# EAGLE design MainBoard (EAGLE 9.4.2)
MF: YAGEO

## Sheet 1 of 2: Power
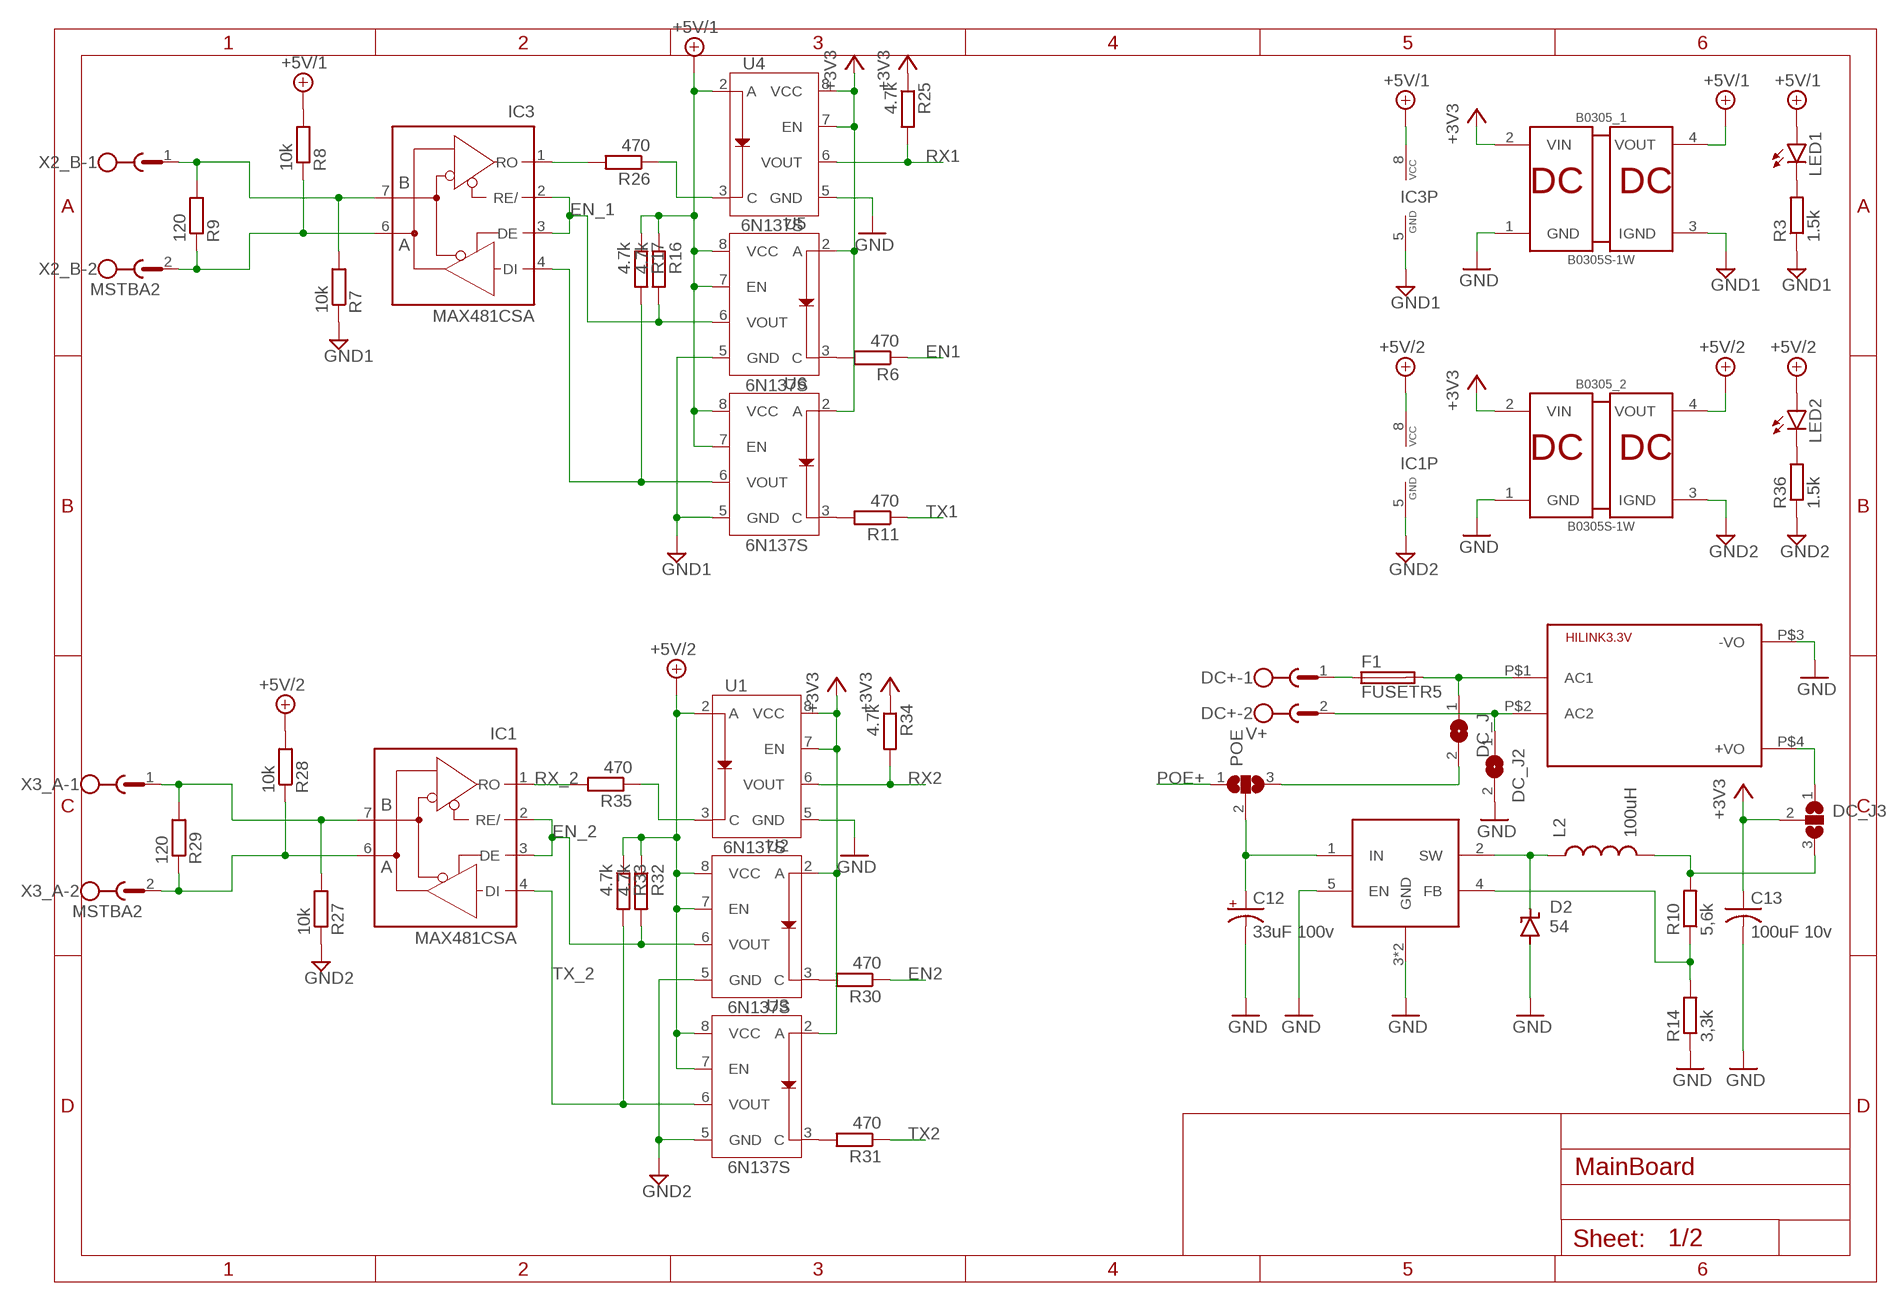
[diagram p0: schematic, sheet 1]

### Parts
B0305_1  B0305S-1W  [B_S-1W]
B0305_2  B0305S-1W  [B_S-1W]
C12  33uF 100v  CPOL-US150CLZ-0810  [150CLZ-0810]
C13  100uF 10v  C-USC1206  [C1206]
D2  54  SUPPRESSOR-SMBJ  [SMBJ]
DC+  V+  MSTBA2  [MSTBA2]
DC_J  SJW  [SJW]
DC_J2  SJW  [SJW]
DC_J3  SJ2W  [SJ_2]
F1  FUSETR5  [TR5]
HILINK3.3V  HLK-PM013W  [HLK-PM01]
IC1  MAX481CSA  [SO08]
IC3  MAX481CSA  [SO08]
L2  100uH  INDUCTOR68UH-1A  [CR75]
LED1  LEDSML1206  [SML1206]
LED2  LEDSML1206  [SML1206]
POE  SJ2W  [SJ_2]
R3  1.5k  R-EU_R0805  [R0805]
R6  470  R-EU_R0805  [R0805]
R7  10k  R-EU_R0805  [R0805]
R8  10k  R-EU_R0805  [R0805]
R9  120  R-EU_R0805  [R0805]
R10  5,6k  R-EU_R0805  [R0805]
R11  470  R-EU_R0805  [R0805]
R14  3,3k  R-EU_R0805  [R0805]
R16  4.7k  R-EU_R0805  [R0805]
R17  4.7k  R-EU_R0805  [R0805]
R25  4.7k  R-EU_R0805  [R0805]
R26  470  R-EU_R0805  [R0805]
R27  10k  R-EU_R0805  [R0805]
R28  10k  R-EU_R0805  [R0805]
R29  120  R-EU_R0805  [R0805]
R30  470  R-EU_R0805  [R0805]
R31  470  R-EU_R0805  [R0805]
R32  4.7k  R-EU_R0805  [R0805]
R33  4.7k  R-EU_R0805  [R0805]
R34  4.7k  R-EU_R0805  [R0805]
R35  470  R-EU_R0805  [R0805]
R36  1.5k  R-EU_R0805  [R0805]
U1  6N137S  [8-SMD]
U2  6N137S  [8-SMD]
U3  6N137S  [8-SMD]
U4  6N137S  [8-SMD]
U5  6N137S  [8-SMD]
U6  6N137S  [8-SMD]
U9  XL7015  [TO252-51]
X2_B  MSTBA2  [MSTBA2]
X3_A  MSTBA2  [MSTBA2]

### Nets
+3V3: B0305_1.2(VIN) B0305_2.2(VIN) C13.1 DC_J3.2 R25.1 R34.1 U1.7(EN) U1.8(VCC) U2.2(A) U3.2(A) U4.7(EN) U4.8(VCC) U5.2(A) U6.2(A) ; also sheet 2
+5V/1: B0305_1.4(VOUT) IC3.8(VCC) LED1.A R8.2 R16.1 R17.1 U4.2(A) U5.7(EN) U5.8(VCC) U6.7(EN) U6.8(VCC)
+5V/2: B0305_2.4(VOUT) IC1.8(VCC) LED2.A R28.2 R32.1 R33.1 U1.2(A) U2.7(EN) U2.8(VCC) U3.7(EN) U3.8(VCC)
EN1: R6.1 ; also sheet 2
EN2: R30.1 ; also sheet 2
EN_1: IC3.2(RE/) IC3.3(DE) R16.2 U5.6(VOUT)
EN_2: IC1.2(RE/) IC1.3(DE) R32.2 U2.6(VOUT)
GND: B0305_1.1(GND) B0305_2.1(GND) C12.- C13.2 D2.A DC_J2.2 HILINK3.3V.P$3(-VO) R14.1 U1.5(GND) U4.5(GND) U9.3(GND) U9.5(EN) U9.GND ; also sheet 2
GND1: B0305_1.3(IGND) IC3.5(GND) R3.1 R7.1 U5.5(GND) U6.5(GND)
GND2: B0305_2.3(IGND) IC1.5(GND) R27.1 R36.1 U2.5(GND) U3.5(GND)
N$1: LED1.C R3.2
N$3: IC3.7(B) R7.2 R9.2 X2_B.1
N$4: IC3.6(A) R8.1 R9.1 X2_B.2
N$6: R10.1 R14.2 U9.4(FB)
N$7: DC_J.2 POE.3
N$8: D2.C L2.P$1 U9.2(SW)
N$9: DC+.2 DC_J2.1 HILINK3.3V.P$2(AC2)
N$10: DC+.1 F1.1
N$11: DC_J3.3 L2.P$2 R10.2
N$12: R6.2 U5.3(C)
N$13: R11.2 U6.3(C)
N$14: IC1.7(B) R27.2 R29.2 X3_A.1
N$15: R26.1 U4.3(C)
N$16: IC1.6(A) R28.1 R29.1 X3_A.2
N$17: R30.2 U2.3(C)
N$18: R31.2 U3.3(C)
N$19: R35.1 U1.3(C)
N$20: LED2.C R36.2
N$22: DC_J3.1 HILINK3.3V.P$4(+VO)
N$26: C12.+ POE.2 U9.1(IN)
N$27: DC_J.1 F1.2 HILINK3.3V.P$1(AC1)
POE+: POE.1 ; also sheet 2
RX1: R25.2 U4.6(VOUT) ; also sheet 2
RX2: R34.2 U1.6(VOUT) ; also sheet 2
RX485: IC3.1(RO) R26.2
RX_2: IC1.1(RO) R35.2
TX1: R11.1 ; also sheet 2
TX2: R31.1 ; also sheet 2
TX485: IC3.4(DI) R17.2 U6.6(VOUT)
TX_2: IC1.4(DI) R33.2 U3.6(VOUT)

## Sheet 2 of 2: LAN
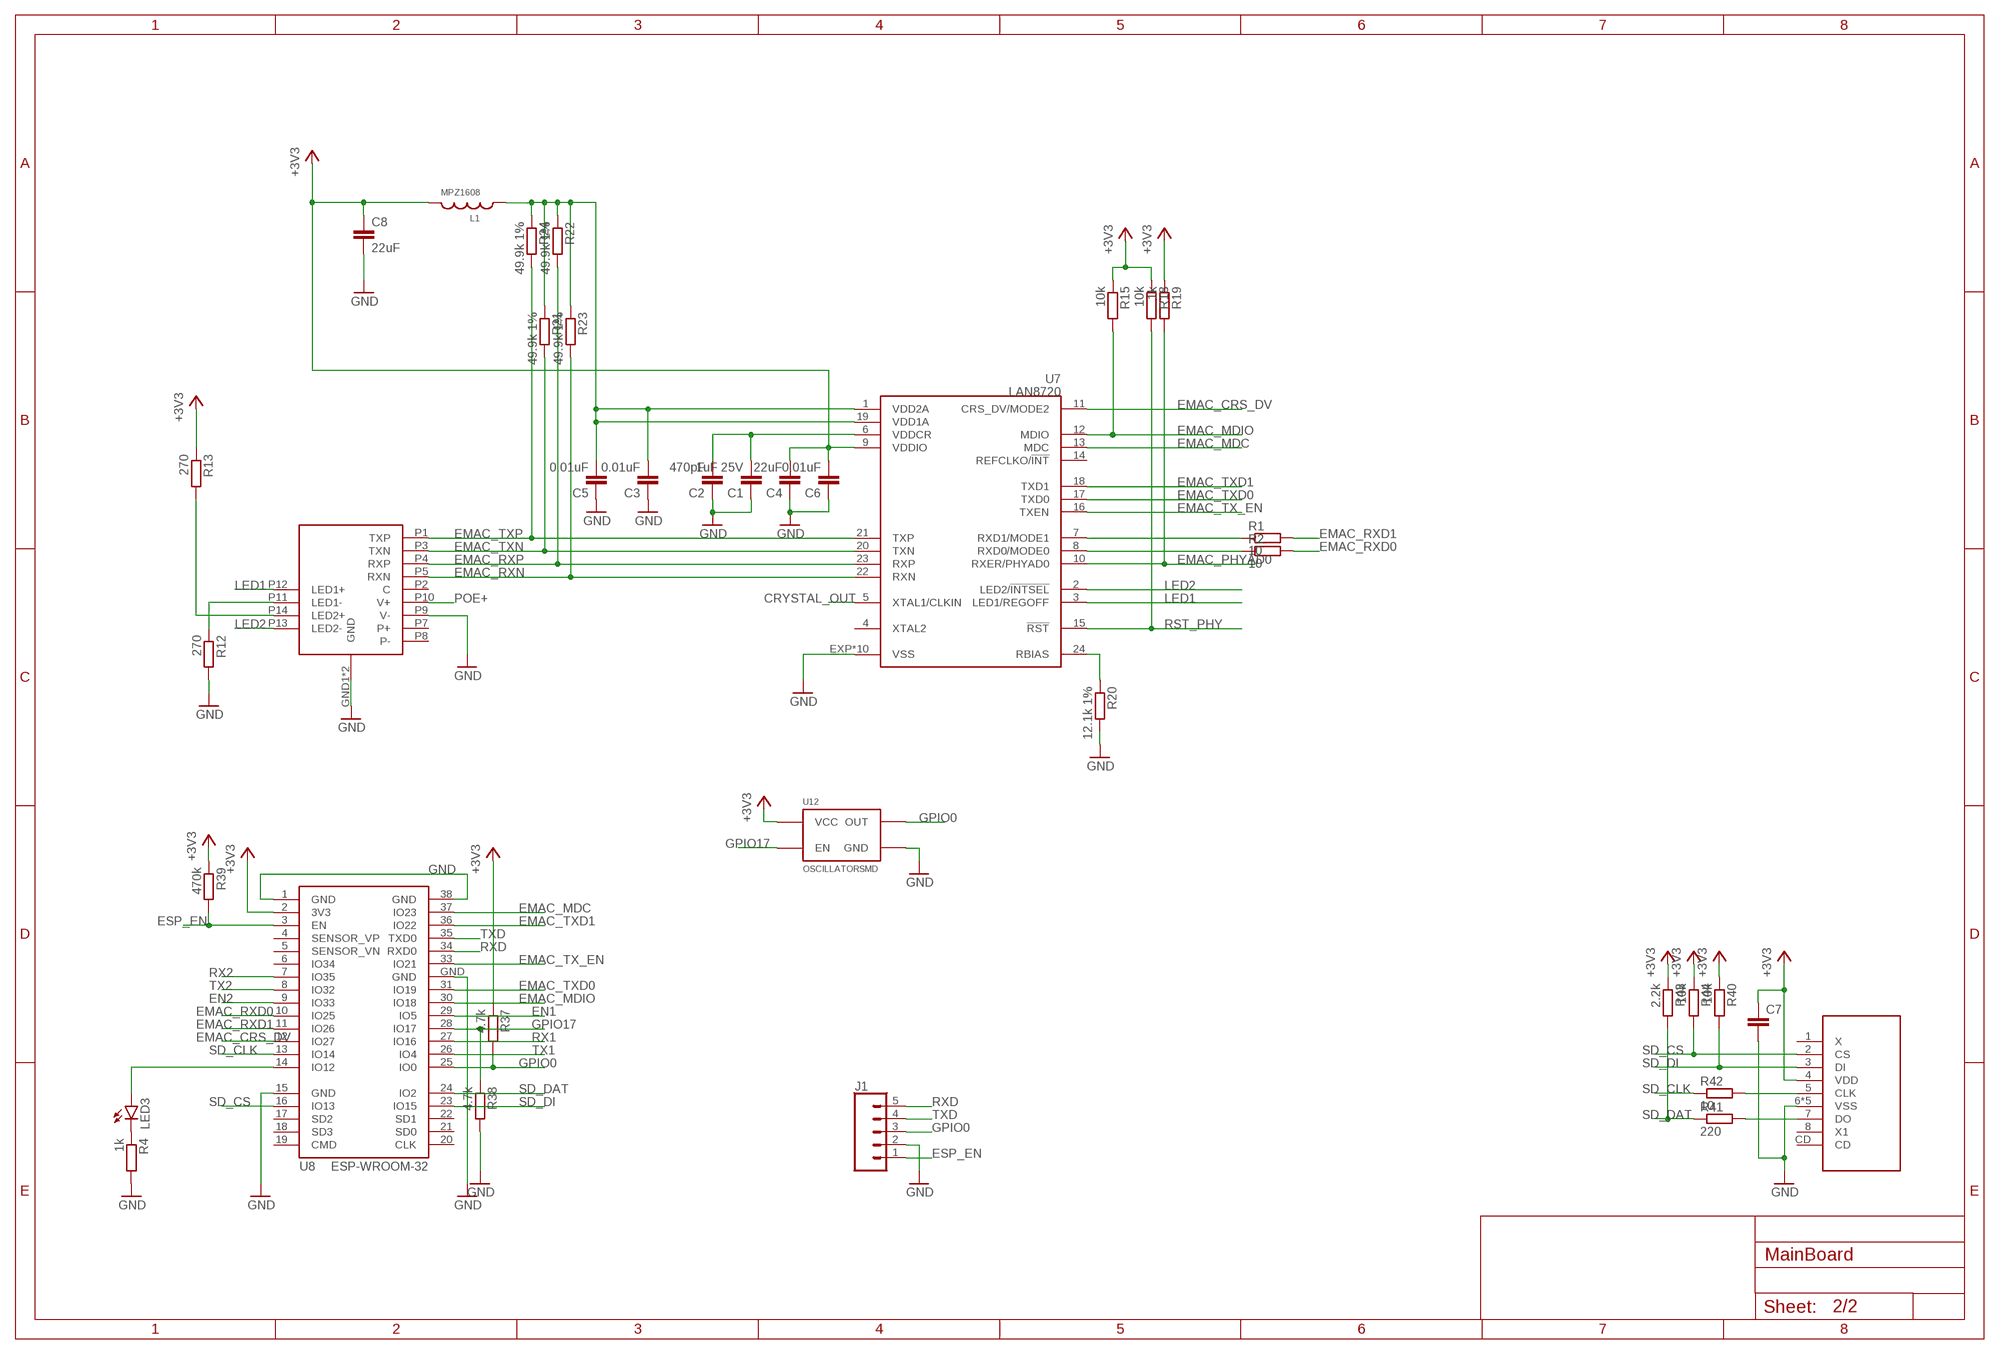
[diagram p1: schematic, sheet 2]

### Parts
C1  1uF 25V  C-EUC0805  [C0805]
C2  470pF  C-EUC0805  [C0805]
C3  0.01uF  C-EUC0805  [C0805]
C4  22uF  C-EUC0805  [C0805]
C5  0.01uF  C-EUC0805  [C0805]
C6  0.01uF  C-EUC0805  [C0805]
C7  C-EUC1206  [C1206]
C8  22uF  C-EUC0805  [C0805]
J1  CONN_05LOCK  [1X05_LOCK]
L1  MPZ1608  [1608]
LED3  LEDSML1206  [SML1206]
R1  10  R-EU_R0805  [R0805]
R2  10  R-EU_R0805  [R0805]
R4  1k  R-EU_R0805  [R0805]
R12  270  R-EU_R0805  [R0805]
R13  270  R-EU_R0805  [R0805]
R15  10k  R-EU_R0805  [R0805]
R18  10k  R-EU_R0805  [R0805]
R19  1k  R-EU_R0805  [R0805]
R20  12.1k 1%  R-EU_R0805  [R0805]
R21  49.9k 1%  R-EU_R0805  [R0805]
R22  49.9k 1%  R-EU_R0805  [R0805]
R23  49.9k 1%  R-EU_R0805  [R0805]
R24  49.9k 1%  R-EU_R0805  [R0805]
R37  4.7k  R-EU_R0805  [R0805]
R38  4.7k  R-EU_R0805  [R0805]
R39  470k  R-EU_R0805  [R0805]
R40  10k  R-EU_R0805  [R0805]
R41  220  R-EU_R0805  [R0805]
R42  10  R-EU_R0805  [R0805]
R43  2.2k  R-EU_R0805  [R0805]
R44  10k  R-EU_R0805  [R0805]
U7  LAN8720  [QFN24]
U8  ESP-WROOM-32  [ESP-WROOM-32]
U12  OSCILLATORSMD  [CRYSTAL-SMD-7X5]
U$1  MICROSD  [MICROSDCARD]
U$2  RJ45-1169  [RJ45-1169]

### Nets
+3V3: C4.2 C6.2 C7.1 C8.1 L1.P$2 R13.1 R15.1 R18.1 R19.1 R37.1 R39.1 R40.1 R43.1 R44.1 U7.9(VDDIO) U8.2(3V3) U12.P$4(VCC) U$1.4(VDD) ; also sheet 1
CRYSTAL_OUT: U7.5(XTAL1/CLKIN)
EMAC_CRS_DV: U7.11(CRS_DV/MODE2) U8.12(IO27)
EMAC_MDC: U7.13(MDC) U8.37(IO23)
EMAC_MDIO: R15.2 U7.12(MDIO) U8.30(IO18)
EMAC_PHYAD0: R19.2 U7.10(RXER/PHYAD0)
EMAC_RBIAS: R20.1 U7.24(RBIAS)
EMAC_RXD0: R2.2 U8.10(IO25)
EMAC_RXD0_LAN: R2.1 U7.8(RXD0/MODE0)
EMAC_RXD1: R1.2 U8.11(IO26)
EMAC_RXD1_LAN: R1.1 U7.7(RXD1/MODE1)
EMAC_RXN: R23.2 U7.22(RXN) U$2.P5(RXN)
EMAC_RXP: R22.2 U7.23(RXP) U$2.P4(RXP)
EMAC_TX_EN: U7.16(TXEN) U8.33(IO21)
EMAC_TXD0: U7.17(TXD0) U8.31(IO19)
EMAC_TXD1: U7.18(TXD1) U8.36(IO22)
EMAC_TXN: R21.2 U7.20(TXN) U$2.P3(TXN)
EMAC_TXP: R24.2 U7.21(TXP) U$2.P1(TXP)
EMAC_VDDCR: C1.2 C2.2 U7.6(VDDCR)
EMAC_VDDXA: C3.2 C5.2 L1.P$1 R21.1 R22.1 R23.1 R24.1 U7.1(VDD2A) U7.19(VDD1A)
EN1: U8.29(IO5) ; also sheet 1
EN2: U8.9(IO33) ; also sheet 1
ESP_EN: J1.1 R39.2 U8.3(EN)
GND: C1.1 C2.1 C3.1 C4.1 C5.1 C6.1 C7.2 C8.2 J1.2 R4.2 R12.2 R20.2 R38.2 U7.EXP(VSS) U7.GND1(VSS) U7.GND2(VSS) U7.GND3(VSS) U7.GND4(VSS) U7.GND5(VSS) U7.GND6(VSS) U7.GND7(VSS) U7.GND8(VSS) U7.GND9(VSS) U8.1(GND) U8.15(GND) U8.38(GND) U8.GND U12.P$2(GND) U$1.6(VSS) U$1.GND1(VSS) U$1.GND2(VSS) U$1.GND3(VSS) U$1.GND(VSS) U$2.GND1(GND) U$2.GND2(GND) U$2.P9(V-) ; also sheet 1
GPIO0: J1.3 R37.2 U8.25(IO0) U12.P$3(OUT)
GPIO17: R38.1 U8.28(IO17) U12.P$1(EN)
LED1: U7.3(LED1/REGOFF) U$2.P12(LED1+)
LED2: U7.2(LED2/!INTSEL) U$2.P13(LED2-)
N$2: R13.2 U$2.P14(LED2+)
N$5: R12.1 U$2.P11(LED1-)
N$21: LED3.A U8.14(IO12)
N$23: LED3.C R4.1
N$24: R41.2 U$1.7(DO)
N$25: R42.2 U$1.5(CLK)
POE+: U$2.P10(V+) ; also sheet 1
RST_PHY: R18.2 U7.15(!RST)
RX1: U8.27(IO16) ; also sheet 1
RX2: U8.7(IO35) ; also sheet 1
RXD: J1.5 U8.34(RXD0)
SD_CLK: R42.1 U8.13(IO14)
SD_CS: R44.2 U8.16(IO13) U$1.2(CS)
SD_DAT: R41.1 R43.2 U8.24(IO2)
SD_DI: R40.2 U8.23(IO15) U$1.3(DI)
TX1: U8.26(IO4) ; also sheet 1
TX2: U8.8(IO32) ; also sheet 1
TXD: J1.4 U8.35(TXD0)
Unconnected: U7.4(XTAL2) U7.14(REFCLKO/!INT) U8.4(SENSOR_VP) U8.5(SENSOR_VN) U8.6(IO34) U8.17(SD2) U8.18(SD3) U8.19(CMD) U8.20(CLK) U8.21(SD0) U8.22(SD1) U$1.1(X) U$1.8(X1) U$1.CD U$2.P2(C) U$2.P7(P+) U$2.P8(P-)

## Library data of the parts
B0305_1 B0305_2 = mornsun:B0305S-1W: 1W, fixed input isolated & unregulated DCDC converter in a miniature sip/dip package
C1 = rcl:C-EU: CAPACITOR, European symbol; MF: YAGEO; MPN: CC0603KPX7R8BB105; SPICEPREFIX: C
C2 = rcl:C-EU: CAPACITOR, European symbol; MF: YAGEO; MPN: CC0603JRX7R7BB471; SPICEPREFIX: C
C3-C6 = rcl:C-EU: CAPACITOR, European symbol; MF: YAGEO; MPN: CC0603KRX7R6BB103; SPICEPREFIX: C
C7 = rcl:C-EU: CAPACITOR, European symbol; SPICEPREFIX: C
C8 = rcl:C-EU: CAPACITOR, European symbol; MF: YAGEO; MPN: CC0603MPX5R5BB226; SPICEPREFIX: C
C12 = rcl:CPOL-US: POLARIZED CAPACITOR, American symbol; SPICEPREFIX: C
C13 = rcl:C-US: CAPACITOR, American symbol; SPICEPREFIX: C
D2 = diode:SUPPRESSOR-: Suppressor diode
DC+ X2_B X3_A = con-phoenix-508:MSTBA2: PHOENIX; MF: FARNELL; MPN: 1757242; OC_FARNELL: 3705171; OC_NEWARK: 71C4161
DC_J DC_J2 = jumper:SJ: SMD solder JUMPER
DC_J3 POE = jumper:SJ2W: SMD solder JUMPER
F1 = fuse:FUSE: Fuse; OC_FARNELL: unknown; OC_NEWARK: unknown
HILINK3.3V = hi-link:HLK-PM01: Hi-Link Power Supply HLK-PM01 3W Author: Ahmed Said <https://github.com/AhmedSaid/EAGLELibraries>
IC1 IC3 = maxim:MAX481CSA: RS485 TRANSEIVER; MF: MAXIM; MPN: MAX481CSA; OC_FARNELL: unknown; OC_NEWARK: 90C3817
J1 = SparkFun-Connectors:CONN_05: Multi connection point. Often used as Generic Header-pin footprint for 0.1 inch spaced/style header connections On any of the 0.1 inch spaced packages, you can populate with these: Break Away Headers - Straight <https://www.sparkfun.com/products/116> (PRT-00116) Break Away Male Headers - Right Angle <https://www.sparkfun.com/products/553> (PRT-00553) Female Headers <https://www.sparkfun.com/products/115> (PRT-00115) Break Away Headers - Machine Pin <https://www.sparkfun.com/products/117> (PRT-00117) Break Away Female Headers - Swiss Machine Pin <https://www.sparkfun.com/products/743> (PRT-00743) For SCREWTERMINALS and SPRING TERMINALS visit here: Screw Terimnals on SparkFun.com <https://www.sparkfun.com/search/results?term=Screw+Terminals> (5mm/3.5mm/2.54mm spacing) This device is also useful as a general connection point to wire up your design to another part of your project. Our various solder wires solder well into these plated through hole pads. Hook-Up Wire - Assortment (Stranded, 22 AWG) <https://www.sparkfun.com/products/11375> (PRT-11375) Hook-Up Wire - Assortment (Solid Core, 22 AWG) <https://www.sparkfun.com/products/11367> (PRT-11367) View the entire wire category on our website here <https://www.sparkfun.com/categories/141> Special notes: Molex polarized connector foot print use with SKU : PRT-08231 with associated crimp pins and housings. 1MM SMD Version SKU: PRT-10208
L1 = candel:MPZ1608: Chip beads for power line MPZ series
L2 = SparkFun-Passives:INDUCTOR: Inductors Basic Inductor/Choke - 0603 and 1206. Footprints are not proven and vary greatly between part numbers. INDUCTOR POWER 3.3UH 4.0A SMD 0.197" L x 0.197" W x 0.177" H (5.00mm x 5.00mm x 4.50mm); PROD_ID: NDUC-09739; VALUE: 68uH
LED1-LED3 = led:LED: LED OSRAM: - CHIPLED LG R971, LG N971, LY N971, LG Q971, LY Q971, LO R971, LY R971 LH N974, LH R974 LS Q976, LO Q976, LY Q976 LO Q996 - Hyper CHIPLED LW Q18S LB Q993, LB Q99A, LB R99A - SideLED LS A670, LO A670, LY A670, LG A670, LP A670 LB A673, LV A673, LT A673, LW A673 LH A674 LY A675 LS A676, LA A676, LO A676, LY A676, LW A676 LS A679, LY A679, LG A679 - Hyper Micro SIDELED® LS Y876, LA Y876, LO Y876, LY Y876 LT Y87S - SmartLED LW L88C, LW L88S LB L89C, LB L89S, LG L890 LS L89K, LO L89K, LY L89K LS L896, LA L896, LO L896, LY L896 - TOPLED LS T670, LO T670, LY T670, LG T670, LP T670 LSG T670, LSP T670, LSY T670, LOP T670, LYG T670 LG T671, LOG T671, LSG T671 LB T673, LV T673, LT T673, LW T673 LH T674 LS T676, LA T676, LO T676, LY T676, LB T676, LH T676, LSB T676, LW T676 LB T67C, LV T67C, LT T67C, LS T67K, LO T67K, LY T67K, LW E67C LS E67B, LA E67B, LO E67B, LY E67B, LB E67C, LV E67C, LT E67C LW T67C LS T679, LY T679, LG T679 LS T770, LO T770, LY T770, LG T770, LP T770 LB T773, LV T773, LT T773, LW T773 LH T774 LS E675, LA E675, LY E675, LS T675 LS T776, LA T776, LO T776, LY T776, LB T776 LHGB T686 LT T68C, LB T68C - Hyper Mini TOPLED® LB M676 - Mini TOPLED Santana® LG M470 LS M47K, LO M47K, LY M47K Source: http://www.osram.convergy.de LUXEON: - LUMILED® LXK2-PW12-R00, LXK2-PW12-S00, LXK2-PW14-U00, LXK2-PW14-V00 LXK2-PM12-R00, LXK2-PM12-S00, LXK2-PM14-U00 LXK2-PE12-Q00, LXK2-PE12-R00, LXK2-PE12-S00, LXK2-PE14-T00, LXK2-PE14-U00 LXK2-PB12-K00, LXK2-PB12-L00, LXK2-PB12-M00, LXK2-PB14-N00, LXK2-PB14-P00, LXK2-PB14-Q00 LXK2-PR12-L00, LXK2-PR12-M00, LXK2-PR14-Q00, LXK2-PR14-R00 LXK2-PD12-Q00, LXK2-PD12-R00, LXK2-PD12-S00 LXK2-PH12-R00, LXK2-PH12-S00 LXK2-PL12-P00, LXK2-PL12-Q00, LXK2-PL12-R00 Source: www.luxeon.com KINGBRIGHT: KA-3528ASYC Source: www.kingbright.com
R1 R2 R15 R18-R24 R40-R44 = rcl:R-EU_: RESISTOR, European symbol; MF: YAGEO; MPN: RC0603JR-0727RL; SPICEPREFIX: R
R3 R6-R11 R14 R16 R17 R25-R36 = rcl:R-EU_: RESISTOR, European symbol; SPICEPREFIX: R
R4 R12 R13 R37-R39 = rcl:R-EU_: RESISTOR, European symbol; MF: YAGEO; MPN: RC0603JR-07240RL; SPICEPREFIX: R
U1-U6 = SparkFun-DiscreteSemi:6N137S: Lite-On 6N137 - High Speed Opto Isolator Opto isolator capable of data rates up to 10MBd; PROD_ID: IC-14151
U7 = candel:LAN8720: LAN8720A/LAN8720Ai Small Footprint RMII 10/100 Ethernet PHY Transceiver with HP Auto-MDIX Support from SMSC / Microchip <http://www.microchip.com>. (C) 2014 Tomasz Boleslaw CEDRO, cederom@tlen.pl, http://www.tomek.cedro.info. Version 0.1 (2014-01-04): Initial release.; MF: MICROCHIP TECHNOLOGY; MPN: LAN8720A-CP-ABC
U8 = esp32wroom:ESP-WROOM-32: Espressif Systems ESP-WROOM-32
U9 = mylibrary:XL7015
U12 = SparkFun-FreqCtrl:OSCILLATOR: Generic 5x3 and 7x5 oscillators
U$1 = mylibrary:MICROSD
U$2 = mylibrary:RJ45-1169: RJ45 HR971169C с трансформатором и PoE

## Board
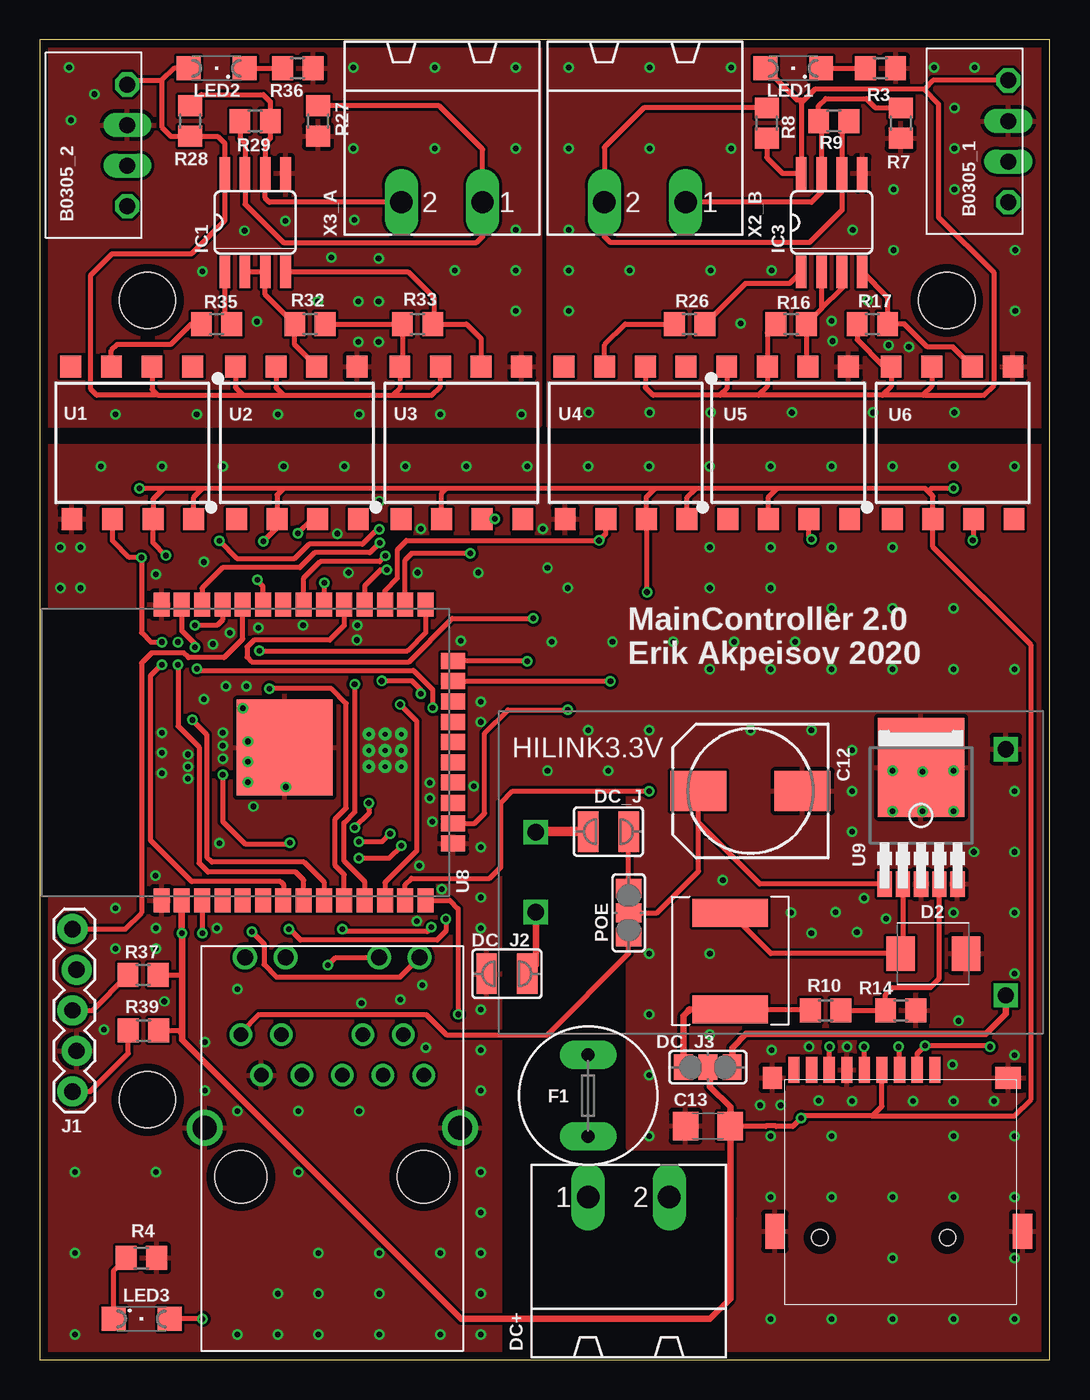
[diagram p2: board, top side]
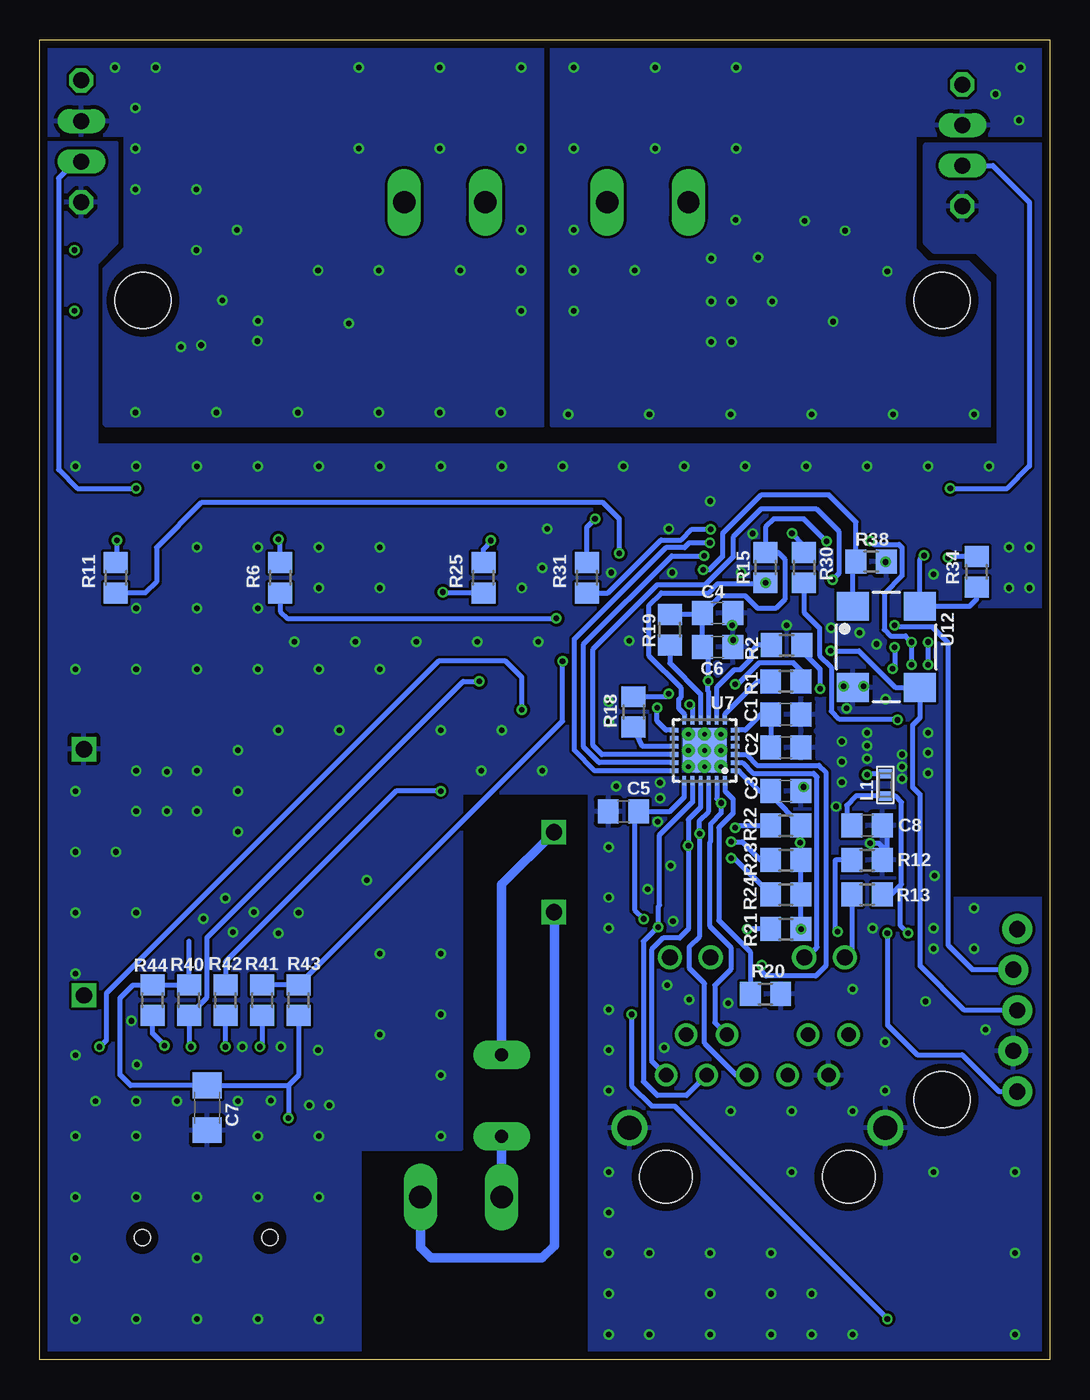
[diagram p3: board, bottom side, seen from below]

Size 63.17 x 82.54 mm. Coordinates in mm from the lower left corner, seen from the top.
Outline: 0,0 63.17,0 63.17,82.54 0,82.54 0,0
Copper layers (1*16): Top 0.035mm / dielectric 1.5mm / Bottom 0.035mm
Design rules "EagleRules": minimum track width 7mil, minimum drill 12mil, track to track 7mil, track to pad 7mil, pad to pad 7mil, via to via 7mil, smd to smd 0mil, copper to edge 20mil, drill to drill 10mil, minimum pad ring 10mil, minimum via ring 6mil, stop-mask expansion 2mil, vias tented up to drill 25mil, thermal gap 10mil
Holes 3.5 mm at 56.73,66.25 6.73,66.25 6.73,16.25

### Footprints (pad centres in the part's own frame; a part is rotated, then mirrored left to right if it is on the bottom)
B_S-1W = drill 1 octagon: 1 -3.81,0; 4 3.81,0 | drill 1 pad 1.27 long: 2 -1.27,0; 3 1.27,0
C0805 = smd 1.3 x 1.5: 1 -0.95,0; 2 0.95,0
C1206 = smd 1.6 x 1.8: 1 -1.4,0; 2 1.4,0
150CLZ-0810 = smd 3.5 x 2.5: + 3.25,0; - -3.25,0
SMBJ = smd 1.78 x 2.16: A 2.04,0; C -2.03,0
MSTBA2 = drill 1.397 long: 1 -2.54,5.08; 2 2.54,5.08
SJW = smd 1.27 x 2.54: 1 -1.27,0; 2 1.27,0
SJ_2 = smd 1.168 x 1.6: 1 -1.524,0; 2 0,0; 3 1.524,0
TR5 = drill 0.813 pad 1.778 long: 1 -2.54,0; 2 2.54,0
HLK-PM01 = drill 1.016 square: P$1 -14.7,2.5; P$2 -14.7,-2.5; P$3 14.7,7.7; P$4 14.7,-7.7
SO08 = smd 0.66 x 2.032: 1 -1.905,-3.073; 2 -0.635,-3.073; 3 0.635,-3.073; 4 1.905,-3.073; 5 1.905,3.073; 6 0.635,3.073; 7 -0.635,3.073; 8 -1.905,3.073
1X05_LOCK = drill 1.016 pad 1.88: 1 0,0.127; 2 2.54,-0.127; 3 5.08,0.127; 4 7.62,-0.127; 5 10.16,0.127
1608 = smd 0.8 x 0.6: P$1 0,0.7; P$2 0,-0.7
CR75 = smd 1.75 x 4.7: P$1 0,0; P$2 6.05,0
SML1206 = smd 1.5 x 1.5: A 1.75,0; C -1.75,0
R0805 = smd 1.3 x 1.5: 1 -0.95,0; 2 0.95,0
8-SMD = smd 1.3 x 1.4: 1 -3.96,-4.96; 2 -1.42,-4.96; 3 1.12,-4.96; 4 3.66,-4.96; 5 3.59,4.58; 6 1.05,4.58; 7 -1.49,4.58; 8 -4.03,4.58
QFN24 = smd 0.6 x 0.3: 1 -1.905,1.27; 2 -1.905,0.762; 3 -1.905,0.254; 4 -1.905,-0.254; 5 -1.905,-0.762; 6 -1.905,-1.27; 13 1.905,-1.27; 14 1.905,-0.762; 15 1.905,-0.254; 16 1.905,0.254; 17 1.905,0.762; 18 1.905,1.27 | smd 0.3 x 0.6: 7 -1.27,-1.905; 8 -0.762,-1.905; 9 -0.254,-1.905; 10 0.254,-1.905; 11 0.762,-1.905; 12 1.27,-1.905; 19 1.27,1.905; 20 0.762,1.905; 21 0.254,1.905; 22 -0.254,1.905; 23 -0.762,1.905; 24 -1.27,1.905 | smd 2.8 x 2.8: EXP 0,0 | drill 0.3 pad 0.4: GND1 -1.016,1.016; GND2 0,1.016; GND3 1.016,1.016; GND4 -1.016,0; GND5 0,0; GND6 1.016,0; GND7 -1.016,-1.016; GND8 0,-1.016; GND9 1.016,-1.016
ESP-WROOM-32 = smd 1.5 x 1: 1 -9.25,7; 2 -9.25,5.73; 3 -9.25,4.46; 4 -9.25,3.19; 5 -9.25,1.92; 6 -9.25,0.65; 7 -9.25,-0.62; 8 -9.25,-1.89; 9 -9.25,-3.16; 10 -9.25,-4.43; 11 -9.25,-5.7; 12 -9.25,-6.97; 13 -9.25,-8.24; 14 -9.25,-9.51; 25 9.25,-9.51; 26 9.25,-8.24; 27 9.25,-6.97; 28 9.25,-5.7; 29 9.25,-4.43; 30 9.25,-3.16; 31 9.25,-1.89; 32 9.25,-0.62; 33 9.25,0.65; 34 9.25,1.92; 35 9.25,3.19; 36 9.25,4.46; 37 9.25,5.73; 38 9.25,7 | smd 1 x 1.5: 15 -5.7,-11.25; 16 -4.43,-11.25; 17 -3.16,-11.25; 18 -1.89,-11.25; 19 -0.62,-11.25; 20 0.65,-11.25; 21 1.92,-11.25; 22 3.19,-11.25; 23 4.46,-11.25; 24 5.73,-11.25 | smd 6 x 6: GND 0.3,-0.7
TO252-51 = smd 0.9 x 1.6: 1 -2.28,-4.8; 2 -1.14,-4.8; 3 0.003,-4.8; 4 1.14,-4.8; 5 2.28,-4.8 | smd 5.4 x 6.2: GND 0,2.5
CRYSTAL-SMD-7X5 = smd 1.8 x 2: P$1 0,0; P$2 5.08,0; P$3 5.08,4.2; P$4 0,4.2
MICROSDCARD = smd 0.7 x 1.6: 1 2.25,10.5; 2 1.15,10.5; 3 0.05,10.5; 4 -1.05,10.5; 5 -2.15,10.5; 6 -3.25,10.5; 7 -4.35,10.5; 8 -5.45,10.5; CD -6.55,10.5 | smd 1.2 x 1.4: GND -7.9,10 | smd 1.2 x 2.2: GND1 -7.75,0.4; GND2 7.75,0.4 | smd 1.6 x 1.4: GND3 6.85,10 | hole 1: -4.93,0; 3.05,0
RJ45-1169 = drill 1.5: GND1 -8,-3.05; GND2 8,-3.05 | drill 0.9: P1 -5.715,-6.35; P2 -4.445,-8.89; P3 -3.175,-6.35; P4 -1.905,-8.89; P5 -0.635,-6.35; P7 1.905,-6.35; P8 3.175,-8.89; P9 4.445,-6.35; P10 5.715,-8.89 | drill 1: P11 -5.465,-13.72; P12 -2.925,-13.72; P13 2.925,-13.72; P14 5.465,-13.72 | hole 3.26: -5.715,0; 5.715,0

### Placement (x,y rotation side)
B0305_1  60.58,76.2 90 top
B0305_2  5.46,75.95 90 top
C1  16.51,40.36 180 bottom
C2  16.51,38.28 180 bottom
C3  16.51,35.56 180 bottom
C4  20.78,46.69 180 bottom
C5  26.67,34.29 0 bottom
C6  20.78,44.58 180 bottom
C7  52.7,15.75 270 bottom
C8  11.43,33.4 0 bottom
C12  44.45,35.56 180 top
C13  41.78,14.61 180 top
D2  55.88,25.4 0 top
DC+  36.83,5.08 0 top
DC_J  35.56,33.02 0 top
DC_J2  29.21,24.13 180 top
DC_J3  41.78,18.29 180 top
F1  34.29,16.51 90 top
HILINK3.3V  45.72,30.48 0 top
IC1  13.46,71.12 0 top
IC3  49.53,71.12 0 top
J1  2.16,16.76 90 top
L1  10.29,35.94 0 bottom
L2  43.18,27.94 270 top
LED1  47.12,80.77 180 top
LED2  11.05,80.77 180 top
LED3  6.35,2.54 0 top
POE  36.83,27.94 90 top
R1  16.51,42.42 0 bottom
R2  16.46,44.68 0 bottom
R3  52.58,80.77 180 top
R4  6.35,6.35 0 top
R6  48.13,48.9 90 bottom
R7  53.85,77.34 90 top
R8  45.47,77.34 270 top
R9  49.66,77.47 180 top
R10  49.15,21.84 180 top
R11  58.42,48.9 90 bottom
R12  11.43,31.24 0 bottom
R13  11.43,29.08 180 bottom
R14  53.85,21.84 180 top
R15  17.78,49.53 270 bottom
R16  46.99,64.77 0 top
R17  52.07,64.77 0 top
R18  26.04,40.51 270 bottom
R19  23.77,45.64 270 bottom
R20  17.78,22.86 0 bottom
R21  16.51,26.92 180 bottom
R22  16.51,33.4 180 bottom
R23  16.51,31.24 180 bottom
R24  16.51,29.08 180 bottom
R25  35.43,48.9 90 bottom
R26  40.64,64.77 0 top
R27  17.4,77.47 90 top
R28  9.4,77.47 270 top
R29  13.46,77.47 180 top
R30  15.37,49.53 90 bottom
R31  28.96,48.9 90 bottom
R32  16.89,64.77 180 top
R33  23.62,64.77 0 top
R34  4.57,49.28 90 bottom
R35  11.05,64.77 0 top
R36  16.13,80.77 180 top
R37  6.45,24.05 180 top
R38  11.18,49.91 0 bottom
R39  6.48,20.57 180 top
R40  53.85,22.48 270 bottom
R41  49.28,22.48 270 bottom
R42  51.56,22.48 270 bottom
R43  46.99,22.48 90 bottom
R44  56.13,22.48 270 bottom
U1  5.59,57.15 180 top
U2  16.26,57.53 0 top
U3  26.54,57.53 0 top
U4  36.45,57.15 180 top
U5  46.99,57.53 0 top
U6  57.28,57.53 0 top
U7  21.59,38.1 180 bottom
U8  14.61,37.97 90 top
U9  55.12,34.54 0 top
U12  12.32,47.12 270 bottom
U$1  53.72,7.62 0 top
U$2  18.29,11.43 180 top
X2_B  37.85,77.47 180 top
X3_A  25.15,77.47 180 top

### Tracks (layer width: path | path; a pad name or v marks a point on that pad's centre or on a via)
+3V3  (via drill 0.35)
  Top 0.305: 52.07,15.24 47.75,15.24 v47.62,15.11 47.09,14.58 46.04,14.58 45.99,14.63 45.45,14.63 45.4,14.58 43.21,14.58 | U$1.4 52.67,15.84 52.07,15.24 | 55.56,54.29 55.86,54 U6.2 55.86,50.82 62,44.68 62,16.28 60.96,15.24 52.07,15.24 | 55.56,54.29 55.37,54.48 46.1,54.48 | 46.1,54.48 41.02,54.48 | 41.02,54.48 38.48,54.48 | 38.48,54.48 25.4,54.48 | 25.4,54.48 15.24,54.48 | 15.24,54.48 10.16,54.48 | 10.16,54.48 7.75,54.48 | 7.75,54.48 7.08,53.81 U1.7 7.08,51.09 v7.87,50.29 | U1.8 9.62,53.94 10.16,54.48 | 15.24,54.48 14.84,54.08 U2.2 14.84,52.04 v13.97,51.18 | U3.2 25.12,54.21 25.4,54.48 | 38.48,54.48 37.94,53.94 U4.7 37.97,52.54 v37.97,48.01 | U4.8 40.48,53.94 41.02,54.48 | U5.2 45.57,53.95 46.1,54.48 | 55.56,54.29 55.75,54.48 v57.15,54.48 | v23.83,41.64 23.83,41.89 23.28,42.44 v21.37,42.44 | 7.75,54.48 v6.22,54.48 | R39.1 8.64,20.57 8.89,20.32 | R37.1 8.81,24.05 8.89,24.13
  Top 0.406: U8.2 v8.88,26.67 8.89,26.66 8.89,24.13 8.89,20.32 8.89,20 26.35,2.54 41.91,2.54 43.18,3.81 43.18,8.89 | DC_J3.2 41.91,18.16 41.91,17.07 43.18,15.8 C13.1 | 43.21,14.58 C13.1 | C13.1 43.18,8.89 | 43.18,8.89
  Bottom 0.305: C7.1 52.67,17.15 | R34.1 4.57,47.56 5.01,47.12 6.17,47.12 6.18,47.12 U12.P$4 8.12,50.05 v7.87,50.29 | C4.2 C6.2 21.37,44.22 v21.37,42.44 21.37,41.8 21.34,41.77 U7.9 | C4.2 21.82,46.59 R19.1 | R43.1 46.99,17.78 47.62,17.14 | C7.1 57.51,17.15 58.17,17.81 58.17,22.61 57.34,23.43 R44.1 R40.1 53.85,26.16 | 21.73,47.07 21.73,46.99 | 21.73,46.99 C4.2 | R25.1 37.66,47.95 37.72,48.01 v37.97,48.01 | C8.1 12.7,33.72 12.7,34.67 12.13,35.24 L1.P$2 9.65,35.24 9.27,34.86 9.27,29.72 9.34,29.65 | R13.1 9.91,29.08 9.34,29.65 | v8.88,26.67 9.34,27.13 9.34,29.65 | v13.97,51.18 15.37,52.58 17.27,52.58 17.78,52.07 R15.1 16.98,50.48 16.57,50.07 16.57,47.55 17.13,46.99 18.27,46.99 19.04,47.77 20.61,47.77 21.39,46.99 21.73,46.99 | R18.1 24,41.46 v23.83,41.64 | v6.22,54.48 2.67,54.48 1.27,55.88 1.27,72.39 3.56,74.68 B0305_2.2 | B0305_1.2 60.96,74.93 62,73.89 62,55.65 60.83,54.48 v57.15,54.48 | 47.62,17.14 v47.62,15.11 | C7.1 47.63,17.15 47.62,17.14
+5V/1
  Top 0.305: R8.2 45.47,75.18 46.46,74.19 IC3.8 47.62,78.6 47.82,78.8 | U4.2 37.87,60.81 38.35,60.33 42.55,60.33 | 52.7,60.33 53.25,60.87 U6.8 52.79,62.11 51.12,63.78 R17.1 | 52.7,60.33 44.96,60.33 | 44.96,60.33 42.55,60.33 | 44.96,60.33 45.5,60.87 U5.7 45.5,64.23 R16.1 | U6.7 55.79,60.87 55.24,60.33 | 55.24,60.33 52.7,60.33 | U5.8 42.96,60.74 42.55,60.33 | B0305_1.4 55.87,80.01 55.31,79.45 | 55.31,79.45 48.48,79.45 47.82,78.8 | LED1.A 47.34,78.8 47.82,78.8 | 55.24,60.33 59.05,60.33 59.69,60.96 59.69,67.97 56.23,71.44 56.23,78.53 55.31,79.45
+5V/2
  Top 0.305: U1.2 7.01,60.68 7.37,60.33 | 7.37,60.33 12.7,60.33 | 12.7,60.33 15.24,60.33 | 15.24,60.33 22.1,60.33 | 22.1,60.33 24.51,60.33 25.05,60.87 U3.7 | 22.1,60.33 22.51,60.74 U3.8 22.67,62.27 R33.1 R32.1 | U2.8 12.23,60.8 12.7,60.33 | U2.7 14.77,60.8 15.24,60.33 | LED2.A 8.38,80.77 7.62,80.01 | 7.62,80.01 7.62,77.09 8.19,76.52 R28.2 11.11,76.52 11.56,76.07 IC1.8 11.56,71.25 9.48,69.17 4.5,69.17 3.17,67.84 3.17,60.71 3.56,60.33 7.37,60.33 | B0305_2.4 5.71,80.01 7.62,80.01
EMAC_CRS_DV  (via drill 0.35)
  Top 0.305: U8.12 21.57,29.83 23.57,31.82 23.57,39.37 23.57,39.92 23.57,39.93 v22.53,40.97
  Bottom 0.305: v22.53,40.97 22.35,40.8 U7.11
EMAC_MDC  (via drill 0.35)
  Top 0.305: v24.56,40.77 24.56,41.91 23.37,43.1 9.93,43.1 v9.83,43.21 | U8.37 8.88,45.6 9.7,44.77 v9.7,44.55
  Bottom 0.305: U7.13 24,39.37 24.56,39.93 v24.56,40.77 | v9.7,44.55 9.7,43.33 v9.83,43.21
EMAC_MDIO  (via drill 0.35)
  Top 0.305: U8.30 17.77,47.63 17.78,47.62 R15.2
  Bottom 0.305: U7.12 22.86,40.37 23.21,40.72 23.21,41.29 23.04,41.46 23.04,41.99 25.06,44.01 25.06,47.19 24.29,47.96 21.33,47.96 20.76,48.53 17.83,48.53 R15.2
  other vias: 17.78,48.58
EMAC_PHYAD0
  Bottom 0.305: U7.10 21.84,41.63 23.77,43.56 R19.2
EMAC_RBIAS
  Bottom 0.305: R20.1 18.73,25.49 20.7,27.46 20.7,33.27 19.81,34.16 19.81,35.05 20.32,35.56 U7.24
EMAC_RXD0  (via drill 0.35)
  Top 0.305: U8.10 19.04,30.34 18.47,30.91 18.47,33.81 19.15,34.49 19.15,41.05 18.24,41.96 v14.36,41.96
  Bottom 0.305: v14.36,41.96 v14.35,41.97 14.35,43.17 15.51,44.33 R2.2
EMAC_RXD0_LAN
  Bottom 0.305: U7.8 20.83,42.06 19.75,43.14 19.38,43.14 18.67,43.85 18.67,44.32 18.31,44.68 R2.1
EMAC_RXD1  (via drill 0.35)
  Top 0.305: v19.68,42.24 19.68,34.24 19.02,33.58 19.02,31.19 20.3,29.91 U8.11
  Bottom 0.305: v19.68,42.24 19.52,42.24 18.18,43.57 16.02,43.57 15.56,43.11 R1.2
EMAC_RXD1_LAN
  Bottom 0.305: U7.7 20.32,40.39 18.29,42.42 R1.1
EMAC_RXN  (via drill 0.35)
  Top 0.305: v21.9,32.89 21.4,32.38 v19.94,32.38
  Bottom 0.305: U$2.P5 19.59,17.78 21.59,19.78 21.59,23.52 22.53,24.46 22.53,25.84 21.89,26.47 v21.89,32.89 v21.9,32.89 21.9,33.72 21.34,34.29 U7.22 | R23.2 18.09,31.24 19.24,32.38 v19.94,32.38
EMAC_RXP  (via drill 0.35)
  Top 0.305: v20.56,34.81 20.56,34.46 20.57,34.45 20.57,34.16 v19.68,33.27
  Bottom 0.305: U$2.P4 20.95,21.08 20.95,23.4 19.95,24.41 19.95,25.79 21.29,27.13 21.29,32.34 21.22,32.41 21.22,33.52 20.56,34.18 v20.56,34.81 20.83,35.08 U7.23 | v19.68,33.27 19.56,33.4 R22.2
EMAC_TX_EN  (via drill 0.35)
  Top 0.305: U8.33 13.96,48.37 13.59,48.73 v13.59,48.77
  Bottom 0.305: U7.16 28.02,37.85 28.57,38.41 28.57,44.44 24.55,48.47 21.54,48.47 19.79,50.21 19.79,51.47 18.05,53.21 14.61,53.21 13.21,51.82 13.21,49.15 v13.59,48.77
EMAC_TXD0  (via drill 0.35)
  Top 0.305: U8.31 16.5,48.88 17.53,49.91 21.26,49.91 v21.61,50.27
  Bottom 0.305: U7.17 28.19,37.34 29.16,38.3 29.16,44.75 23.65,50.27 v21.61,50.27
EMAC_TXD1  (via drill 0.35)
  Top 0.305: U8.36 10.14,48.24 11.43,49.53 16.26,49.53 17.2,50.47 20.65,50.47 v21.26,51.08
  Bottom 0.305: U7.18 28.46,36.83 29.74,38.12 29.74,45.07 24.02,50.79 22.85,50.79 22.56,51.08 v21.26,51.08
EMAC_TXN  (via drill 0.35)
  Top 0.305: v18.92,26.92 19.07,26.77 24.23,26.77 v24.49,27.03
  Bottom 0.305: U$2.P3 22.73,16.52 24.55,16.52 25.42,17.39 25.42,26.16 24.55,27.03 v24.49,27.03 24.49,28.34 24.4,28.43 24.4,32.81 22.35,34.86 U7.20 | R21.2 v18.92,26.92
EMAC_TXP  (via drill 0.35)
  Top 0.305: v19.94,31.37 21.84,31.37 v22.61,32.13
  Bottom 0.305: U$2.P1 24.91,18.69 24.91,25.65 24.19,26.36 23.16,26.36 22.61,26.92 v22.61,32.13 22.61,33.78 21.84,34.54 U7.21 | R24.2 19.75,31.37 v19.94,31.37
EMAC_VDDCR
  Bottom 0.305: C2.2 C1.2 18.06,40.36 19.05,39.37 U7.6
EMAC_VDDXA  (via drill 0.35)
  Top 0.305: v11.43,36.58 11.43,33.66 12.83,32.26 15.63,32.26 v15.63,32.32 | v25.4,27.56 25.4,26.8 24.84,26.24 16.3,26.24 15.62,26.92 R21.1
  Bottom 0.305: U7.19 22.86,35.18 23.75,34.29 C5.2 25.97,34.04 25.97,28.13 v25.4,27.56 | U7.1 19.43,36.83 18.16,35.56 C3.2 17.46,35.3 R22.1 15.56,32.38 | R21.1 R24.1 R23.1 15.56,32.38 | L1.P$1 11.37,36.64 v11.43,36.58 | v15.63,32.32 v15.62,32.32 15.56,32.38
  other vias: 15.56,26.92
EN1  (via drill 0.35)
  Top 0.305: U8.29 19.04,45.91 18.13,45.01 13.38,45.01 12.95,44.58 12.95,43.94 13.26,43.64 23.08,43.64 25.79,46.35 v30.86,46.35
  Bottom 0.305: R6.1 48.13,46.8 47.69,46.35 v30.86,46.35
EN2  (via drill 0.35)
  Top 0.305: v9.53,40.01 10.44,39.09 10.44,31.42 10.74,31.11 16.51,31.11 17.77,29.86 U8.9
  Bottom 0.305: R30.1 15.37,46.74 14.4,45.77 14.4,44.04 13.68,43.32 13.68,40.55 13.16,40.04 9.56,40.04 v9.53,40.01
EN_1
  Top 0.305: IC3.2 48.9,65.72 | 48.9,65.72 48.1,64.93 R16.2 47.94,62.21 U5.6 | IC3.3 50.16,67 48.9,65.72
EN_2
  Top 0.305: U2.6 15.94,63.48 R32.2 14.1,66.61 IC1.3 IC1.2
ESP_EN  (via drill 0.35)
  Top 0.305: U8.3 10.14,26.68 v10.16,26.67 | J1.1 3.15,16.76 5.53,19.14 R39.2
  Bottom 0.305: v10.16,26.67 10.16,20.93 8.3,19.07 5.48,19.07 3.17,16.76 J1.1
GND  (via drill 0.35)
  Bottom 0.305: v11.23,32.31 10.72,32.31 10.16,31.75 10.16,33.08 C8.2
  other vias: 3.81,55.88 7.62,55.88 11.43,55.88 15.24,55.88 19.05,55.88 22.86,55.88 26.67,55.88 30.48,55.88 34.29,55.88 38.1,55.88 41.91,55.88 45.72,55.88 49.53,55.88 53.34,55.88 57.15,55.88 60.96,55.88 53.34,50.8 49.53,50.8 53.34,46.99 53.34,43.18 57.15,43.18 57.15,46.99 60.96,43.18 49.53,43.18 45.72,43.18 41.91,43.18 41.91,50.8 45.72,50.8 49.53,46.99 53.34,36.83 57.15,36.83 57.15,34.29 53.34,34.29 55.22,36.78 55.22,34.29 60.96,35.56 60.96,31.75 60.96,27.94 60.96,24.13 60.96,19.05 60.96,13.97 60.96,10.16 60.96,6.35 60.96,2.54 57.15,2.54 53.34,2.54 49.53,2.54 45.72,2.54 53.34,6.35 53.34,10.16 57.15,13.97 49.53,13.97 45.72,13.97 49.53,10.16 57.15,10.16 45.72,10.16 38.1,13.97 38.1,17.78 38.1,21.59 38.1,25.4 41.91,25.4 42.72,29.97 48.26,26.67 46.99,27.94 52.93,27.58 51.1,26.72 49.78,27.99 51.56,28.85 57.15,27.94 58.42,31.75 50.8,33.02 50.8,35.56 50.8,38.1 48.26,39.37 44.45,39.37 38.1,39.37 34.29,39.37 35.56,36.83 31.75,36.83 27.58,41.15 27.58,39.88 26.31,44.96 24.38,36.07 24.38,35.1 27.13,35.86 27.58,32.05 27.58,28.91 27.58,26.97 27.58,21.89 27.58,19.35 27.58,16.81 27.58,11.73 27.58,9.19 27.58,6.65 27.58,4.11 27.58,1.57 25.04,1.57 21.23,1.57 17.42,1.57 14.88,1.57 12.34,1.57 21.23,4.11 17.42,4.11 14.88,4.11 25.04,6.65 21.23,6.65 17.42,6.65 2.18,1.57 2.18,6.65 2.18,11.73 7.26,11.73 16.15,11.73 16.15,15.54 19.96,15.54 12.34,15.54 12.34,23.16 4.72,28.24 4.72,25.7 4.01,20.62 11.07,26.97 22.56,22.5 24.54,33.63 23.72,30.89 23.93,23.42 24.13,19.51 20.12,22.3 7.26,26.97 7.26,25.7 13,38.66 13,37.39 13,36.12 11.43,39.22 11.43,37.59 10.26,41.3 12.9,42.11 11.63,42.11 32,44.91 35.81,44.91 39.62,44.91 43.43,44.91 47.24,44.91 41.91,48.26 45.72,48.26 31.75,49.53 33.02,48.26 2.54,50.8 2.54,48.26 1.27,48.26 1.27,50.8 19.81,45.01 21.23,53.7 18.59,51.66 19.3,49.23 41.91,20.32 46.33,15.9 45.06,15.9 45.77,19.35 48.72,16.21 50.8,16.15 54.61,16.15 57.15,16.15 59.69,16.15 13.36,34.59 7.21,30.28 7.62,39.22 7.62,37.95 7.62,36.68 9.25,37.85 9.25,37.08 9.25,36.32 11.43,38.4 12.7,40.74 15.39,35.81 11.89,45.47 10.82,44.75 7.26,49.12 10.26,49.89 23.83,51.97 31.45,51.97 7.77,22.4 10.31,19.86 10.31,16.81 16.46,45.92 13.67,45.77 19.86,45.92 23.62,49.23 27.43,49.23 57.45,21.18 57.1,18.44 48.11,19.56 50.5,19.56 23.57,27.43 25.15,29.41
  pour Bottom: 0,57.15 63.5,57.15 63.5,0 43.18,0 43.18,13.21 36.83,13.21 36.83,35.51 28.75,35.51 28.75,0 0,0
  pour Top: 0,57.15 63.5,57.15 63.5,0 43.18,0 43.18,13.21 36.83,13.21 36.83,35.56 28.75,35.56 28.75,0 0,0
  pour Bottom: 63.5,76.1 58.42,76.1 58.42,69.85 59.69,68.58 59.69,57.15 63.5,57.15
  pour Bottom: 7.77,75.96 7.73,76 0.1,76 0.1,57.25 0,57.15 3.15,57.15 3.15,67.92 4.52,69.29 7.21,69.29 7.77,69.85
GND1  (via drill 0.35)
  other vias: 33.07,80.82 33.07,75.74 38.15,80.82 43.23,80.82 38.15,75.74 43.23,75.74 33.07,70.66 33.07,65.58 33.07,68.12 36.88,68.12 34.34,59.23 38.15,59.23 57.2,59.23 52.12,59.23 47.04,59.23 41.96,59.23 57.2,78.28 55.93,80.82 58.47,80.82 53.39,69.39 53.39,73.2 50.85,70.66 57.2,73.2 57.2,75.74 61.01,69.39 61.01,65.58 45.77,68.12 41.96,68.12 43.84,64.82 51.77,66.24 49.53,64.97 49.58,63.7 53.09,63.45 54.36,63.35
  pour Top: 31.8,82.55 31.8,58.42 63.5,58.42 63.5,82.55
  pour Bottom: 31.75,82.55 63.5,82.55 63.5,76.81 63.45,76.76 63.35,76.66 57.81,76.66 57.81,69.49 59.13,68.17 59.13,58.57 59.03,58.47 31.8,58.47 31.75,58.42
GND2  (via drill 0.35)
  other vias: 3.4,79.15 1.83,80.82 1.93,77.52 19.61,80.82 24.69,80.82 29.77,80.82 29.77,75.74 29.77,70.66 24.69,75.74 19.61,75.74 29.77,65.58 25.96,68.12 18.24,68.94 21.18,63.65 19.91,63.65 19.91,66.19 21.18,66.19 21.18,68.88 17.37,66.19 13.56,64.92 4.72,59.13 9.8,59.13 14.88,59.13 19.96,59.13 25.04,59.13 30.12,59.13 29.77,68.12 10.16,68.07 12.8,70.61 15.34,71.22 19.66,71.27
  pour Top: 0,82.55 31.24,82.55 31.24,58.42 0,58.42
  pour Bottom: 0,82.55 31.09,82.55 31.14,82.5 31.14,58.47 3.86,58.47 3.81,58.42 3.81,67.31 5.08,68.58 7.62,68.58 8.48,69.44 8.48,76.61 8.53,76.66 0.25,76.66 0,76.91
GPIO0  (via drill 0.35)
  Top 0.305: J1.3 3.29,21.84 R37.2 | v13.72,44.32 22.99,44.32 24.13,45.47 24.13,47.21 U8.25
  Bottom 0.305: v13.72,44.32 11.94,44.32 9.65,42.04 U12.P$3 8.12,40.14 8.59,39.67 8.59,35.81 8.13,35.36 8.13,24.64 5.33,21.84 J1.3
GPIO17  (via drill 0.35)
  Top 0.305: U8.28 20.32,47.24 20.32,48.39 21.34,49.4 v21.69,49.4
  Bottom 0.305: v21.69,49.4 21.29,49.4 20.47,50.22 20.47,51.66 18.03,54.1 13.84,54.1 12.13,52.38 R38.1 12.32,49.72 U12.P$1
LED1  (via drill 0.35)
  Top 0.305: v18.01,24.66 18.5,25.15 U$2.P12
  Bottom 0.305: U7.3 18.99,37.85 18.32,37.17 14.44,37.17 14.02,36.75 14.02,24.61 14.64,23.99 17.76,23.99 18.01,24.24 v18.01,24.66
LED2
  Bottom 0.305: U$2.P13 15.2,25.15 14.55,25.79 14.55,36.44 14.78,36.67 18.56,36.67 19.23,37.34 U7.2
N$1
  Top 0.305: LED1.C R3.2
N$2
  Bottom 0.305: U$2.P14 12.38,25.59 R13.2
N$3
  Top 0.305: R7.2 52.27,78.29 51.7,78.87 49.15,78.87 48.71,78.42 R9.2 48.9,77.28 IC3.7 48.9,73.03 48.26,72.39 X2_B.1
N$4
  Top 0.305: R9.1 50.16,77.03 IC3.6 50.16,71.88 48.15,69.86 35.67,69.86 35.31,70.23 X2_B.2 35.31,75.82 37.78,78.29 R8.1
N$5  (via drill 0.35)
  Top 0.305: v13.26,26.77 13.26,26.75 14.01,26 14.01,24.7 14.78,23.93 22.53,23.93 U$2.P11
  Bottom 0.305: v13.26,26.77 13.44,26.95 13.44,31.2 13.4,31.24 R12.1
N$6
  Top 0.305: R10.1 R14.2 52.9,22.82 53.34,23.27 55.7,23.27 56.26,23.82 U9.4
N$7
  Top 0.305: POE.3 DC_J.2
N$8
  Top 0.305: U9.2 53.98,25.53 D2.C 45.72,25.4 L2.P$1
N$9
  Top 0.406: DC_J2.1 31.02,24.67 HILINK3.3V.P$2
  Bottom 0.61: HILINK3.3V.P$2 30.99,27.95 30.99,7.11 31.75,6.35 38.71,6.35 39.37,7.01 DC+.2
N$10
  Bottom 0.61: DC+.1 F1.1
N$11
  Top 0.305: L2.P$2 48.15,21.89 R10.2
  Top 0.406: DC_J3.3 40.26,21.51 40.49,21.74 40.64,21.89 L2.P$2
N$12  (via drill 0.35)
  Top 0.305: v48.26,51.31 48.11,51.46 U5.3
  Bottom 0.305: R6.2 48.13,51.31 v48.26,51.31
N$13  (via drill 0.35)
  Top 0.305: U6.3 58.4,51.33 58.42,51.31 v58.36,51.24
  Bottom 0.305: v58.36,51.24 58.36,49.91 R11.2
N$14
  Top 0.305: R29.2 12.51,76.39 12.83,76.07 IC1.7 12.83,72.26 15.23,69.86 27.32,69.86 27.69,70.23 X3_A.1 27.69,75.69 24.96,78.42 R27.2
N$15
  Top 0.305: U4.3 35.33,63.48 36.62,64.77 R26.1
N$16
  Top 0.305: X3_A.2 14.35,72.39 14.1,72.64 IC1.6 14.1,76.07 14.41,76.39 R29.1 14.41,78.68 13.97,79.12 10.1,79.12 R28.1
N$17  (via drill 0.35)
  Top 0.305: v16.13,51.69 17.01,52.57 U2.3
  Bottom 0.305: R30.2 15.37,50.93 v16.13,51.69
N$18  (via drill 0.35)
  Top 0.305: v28.45,52.58 v28.44,52.57 U3.3
  Bottom 0.305: R31.2 28.96,52.07 v28.45,52.58
N$19
  Top 0.305: R35.1 9.46,64.77 8.19,63.5 4.83,63.5 4.47,63.13 U1.3
N$20
  Top 0.305: LED2.C R36.2
N$21  (via drill 0.35)
  Top 0.305: U8.14 25.64,28.72 26.16,28.2 v26.16,21.59 | v10.16,2.54 LED3.A
  Bottom 0.305: v10.16,2.54 23.48,15.86 24.89,15.86 26.16,17.13 v26.16,21.59
N$22
  Top 0.406: HILINK3.3V.P$4 60.42,21.61 59.18,20.37 44.17,20.37 43.31,19.51 DC_J3.1
N$23
  Top 0.305: LED3.C 4.6,5.55 R4.1
N$24  (via drill 0.35)
  Top 0.305: U$1.7 49.37,19.53 v49.4,19.56
  Bottom 0.305: R41.2 49.28,19.68 v49.4,19.56
N$25  (via drill 0.35)
  Top 0.305: U$1.5 51.57,19.55 v51.56,19.56
  Bottom 0.305: v51.56,19.56 R42.2
N$26
  Top 0.305: 41.2,33.58 C12.+ | U9.1 45.04,29.74 41.2,33.58 | POE.2 38.61,27.94 41.2,30.53 41.2,33.58
N$27
  Top 0.61: DC_J.1 31.06,33.02 HILINK3.3V.P$1
  Bottom 0.61: F1.2 34.29,29.71 HILINK3.3V.P$1
POE+
  Top 0.305: U$2.P10 12.57,20.48 13.68,21.58 24.17,21.58 25.43,20.32 31.75,20.32 36.83,25.4 POE.1
RST_PHY
  Bottom 0.305: U7.15 25.47,38.35 R18.2
RX1  (via drill 0.35)
  Top 0.305: U4.6 35.4,51.66 v34.97,51.23 22.93,51.23 22.36,50.66 22.36,48.87 21.57,48.08 U8.27
  Bottom 0.305: R25.2 35.43,50.67 34.92,51.18 v34.97,51.23
RX2  (via drill 0.35)
  Top 0.305: v7.62,44.88 6.94,44.88 6.35,45.47 v6.35,50.16 5.59,50.16 4.54,51.22 U1.6 | U8.7 15.24,28.74 15.24,29.72 15.05,29.91 9.5,29.91 6.91,32.49 6.91,42.76 v7.62,43.47
  Bottom 0.305: R34.2 6.35,50.23 v6.35,50.16 | v7.62,44.88 v7.62,43.47
RX485
  Top 0.305: IC3.1 46.89,67.31 44.13,67.31 R26.2
RX_2
  Top 0.305: IC1.1 11.56,65.21 R35.2
RXD
  Top 0.305: J1.5 5.33,26.92 6.35,27.94 6.35,43.56 6.99,44.2 8.99,44.2 9.29,43.9 11.51,43.9 12.69,45.07 U8.34
SD_CLK  (via drill 0.35)
  Top 0.305: U8.13 22.84,29.7 23.24,30.1 28.12,30.1 28.83,30.81 28.83,34.82 29.57,35.56 v38.1,35.56
  Bottom 0.305: v38.1,35.56 40.89,35.56 51.56,24.89 R42.1
SD_CS  (via drill 0.35)
  Top 0.305: U$1.2 54.87,19.14 v55.37,19.64 59.36,19.64 v59.44,19.56 | U8.16 27.19,33.54 27.82,34.17 27.82,39.18 29.28,40.64 v33.02,40.64
  Bottom 0.305: v55.37,19.64 56.13,20.4 R44.2 | v59.44,19.56 59,19.99 59,22.92 38.24,43.69 34.04,43.69 33.02,42.67 v33.02,40.64
SD_DAT  (via drill 0.35)
  Top 0.305: v30.48,43.69 25.87,43.69 U8.24
  Bottom 0.305: R41.1 R43.2 30.48,39.94 v30.48,43.69
SD_DI  (via drill 0.35)
  Top 0.305: U$1.3 53.77,19.51 v53.72,19.56 | v35.69,42.42 35.67,42.43 U8.23
  Bottom 0.305: v53.72,19.56 53.85,19.68 R40.2 52.72,22.66 52.72,26.4 36.7,42.42 v35.69,42.42
TX1  (via drill 0.35)
  Top 0.305: v26.92,50.42 23.24,50.42 22.84,50.02 U8.26
  Bottom 0.305: R11.1 56.58,47.95 55.88,48.64 55.88,50.8 53.09,53.59 27.94,53.59 26.92,52.58 v26.92,50.42
TX2  (via drill 0.35)
  Top 0.305: U8.8 16.5,29.99 15.99,30.49 10.52,30.49 9.96,31.05 9.96,38.3 8.64,39.62 v8.64,43.47 | v8.64,44.88 8.64,44.9 | v21.23,51.94 21.11,51.94 20.17,51 16.83,51 15.94,50.11 12.32,50.11 v11.23,51.21
  Bottom 0.305: v8.64,43.47 v8.64,44.88 9.02,45.27 9.97,45.27 10.36,45.65 10.36,47.91 9.25,49.02 9.25,50.8 9.44,50.99 11.01,50.99 v11.23,51.21 | R31.1 27.64,47.95 24.32,51.27 23.05,51.27 22.38,51.94 v21.23,51.94
TX485
  Top 0.305: U6.6 57.11,63.33 55.52,63.33 54.08,64.77 R17.2 53.02,66.46 IC3.4
TX_2
  Top 0.305: IC1.4 23.01,68.05 24.64,66.42 24.64,64.84 R33.2 26.67,64.77 27.59,63.85 U3.6
TXD  (via drill 0.35)
  Top 0.305: U8.35 11.41,46.26 11.07,45.92 v9.7,45.92
  Bottom 0.305: J1.4 4.83,24.38 6.35,25.91 6.35,44.83 7.37,45.85 9.63,45.85 v9.7,45.92

### Text on the board
tNames: MainController 2.0 / Erik Akpeisov 2020